# EAGLE design LCD&ControlRev1 (EAGLE 9.2.2)
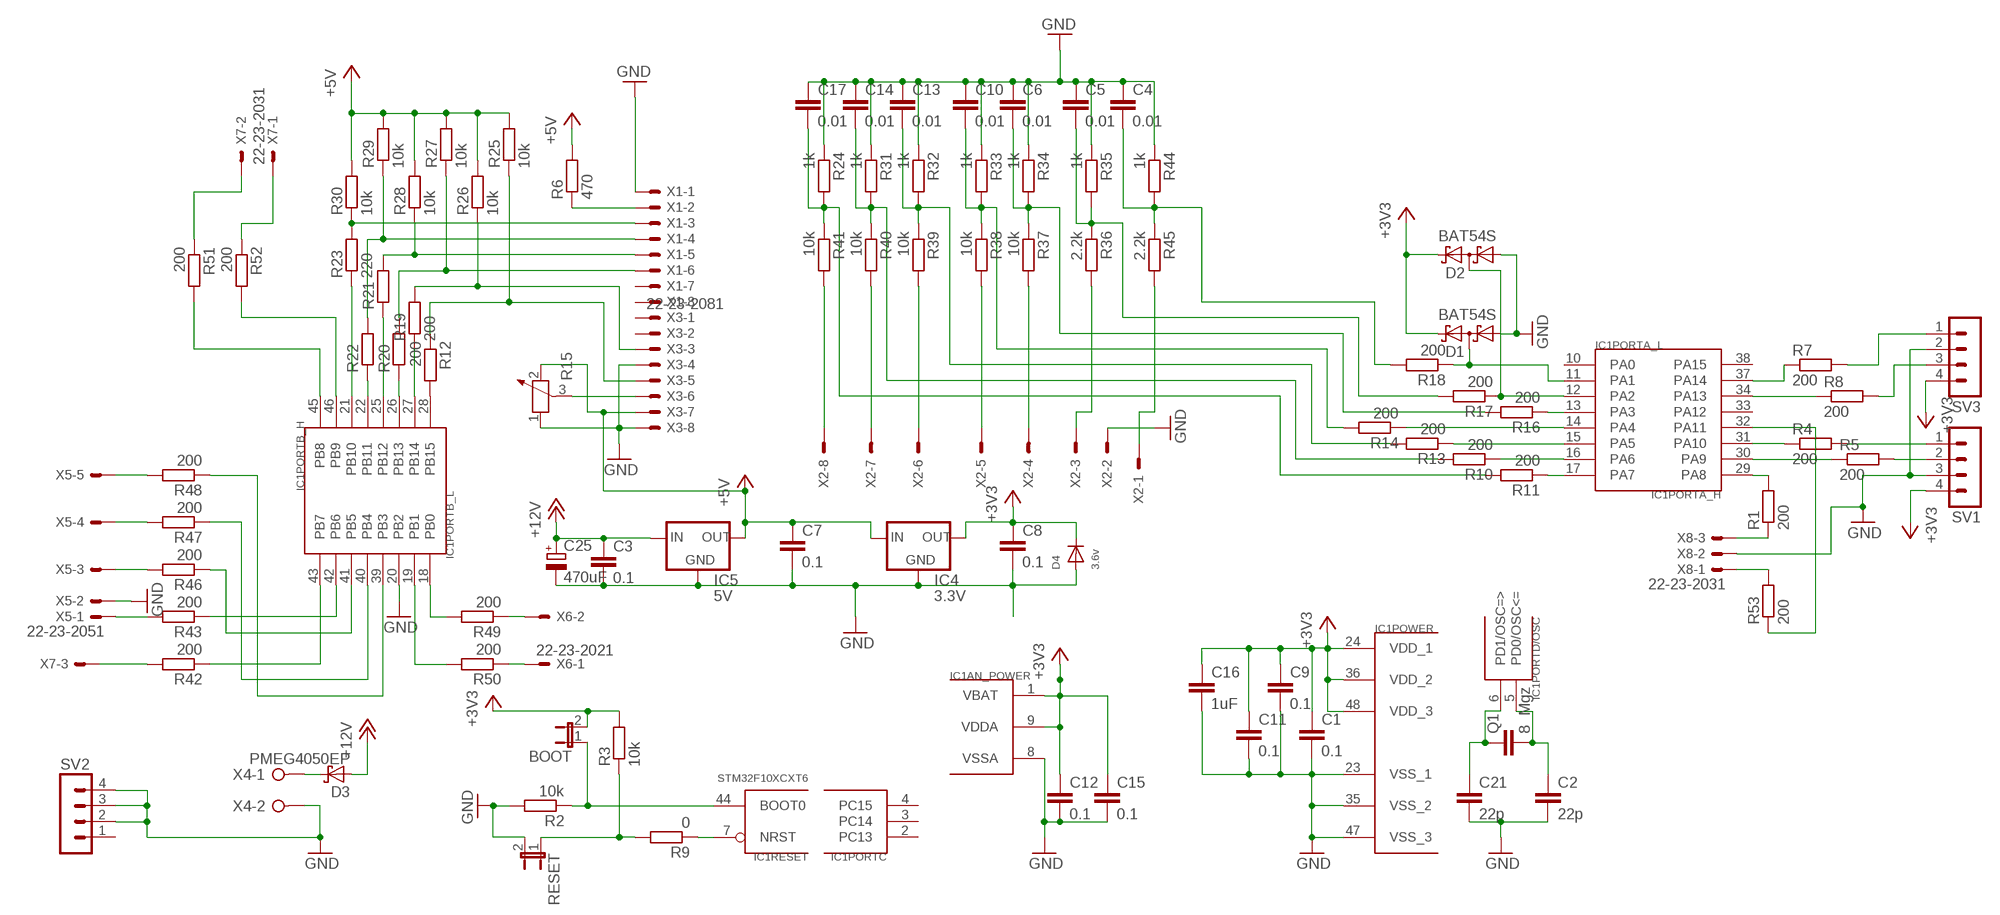
[diagram p0: schematic, sheet 1]

## Parts
BOOT  JP1E  [JP1]
C1  0.1  C-EUC0402  [C0402]
C2  22p  C-EUC0603  [C0603]
C3  0.1  C-EUC1206  [C1206]
C4  0.01  C-EUC0603  [C0603]
C5  0.01  C-EUC0603  [C0603]
C6  0.01  C-EUC0603  [C0603]
C7  0.1  C-EUC1206  [C1206]
C8  0.1  C-EUC1206  [C1206]
C9  0.1  C-EUC0402  [C0402]
C10  0.01  C-EUC0603  [C0603]
C11  0.1  C-EUC0402  [C0402]
C12  0.1  C-EUC0402  [C0402]
C13  0.01  C-EUC0603  [C0603]
C14  0.01  C-EUC0603  [C0603]
C15  0.1  C-EUC0402  [C0402]
C16  1uF  C-EUC0603  [C0603]
C17  0.01  C-EUC0603  [C0603]
C21  22p  C-EUC0603  [C0603]
C25  470uF  CPOL-EUE5-10.5  [E5-10,5]
D1  BAT54S  [SOT23]
D2  BAT54S  [SOT23]
D3  PMEG4050EP  [SOD128]
D4  3.6v  DIODESOD-123  [SOD-123]
IC1  STM32F10XCXT6  [TQFP48]
IC4  3.3V  LM1117  [SOT223]
IC5  5V  LM1117  [SOT223]
Q1  8 Mgz  C-EU050-024X044  [C050-024X044]
R1  200  R-EU_R0603  [R0603]
R2  10k  R-EU_R0603  [R0603]
R3  10k  R-EU_M1206  [M1206]
R4  200  R-EU_R0603  [R0603]
R5  200  R-EU_R0603  [R0603]
R6  470  R-EU_R0603  [R0603]
R7  200  R-EU_R0603  [R0603]
R8  200  R-EU_R0603  [R0603]
R9  0  R-EU_M1206  [M1206]
R10  200  R-EU_R0603  [R0603]
R11  200  R-EU_R0603  [R0603]
R12  200  R-EU_M1206  [M1206]
R13  200  R-EU_R0603  [R0603]
R14  200  R-EU_R0603  [R0603]
R15  POTENTIOMETER_PT-10S  [PT-10S]
R16  200  R-EU_R0603  [R0603]
R17  200  R-EU_R0603  [R0603]
R18  200  R-EU_R0603  [R0603]
R19  200  R-EU_R0603  [R0603]
R20  R-EU_R0603  [R0603]
R21  R-EU_R0603  [R0603]
R22  R-EU_R0603  [R0603]
R23  220  R-EU_R0603  [R0603]
R24  1k  R-EU_R0603  [R0603]
R25  10k  R-EU_R0603  [R0603]
R26  10k  R-EU_R0603  [R0603]
R27  10k  R-EU_R0603  [R0603]
R28  10k  R-EU_R0603  [R0603]
R29  10k  R-EU_R0603  [R0603]
R30  10k  R-EU_R0603  [R0603]
R31  1k  R-EU_R0603  [R0603]
R32  1k  R-EU_R0603  [R0603]
R33  1k  R-EU_R0603  [R0603]
R34  1k  R-EU_R0603  [R0603]
R35  1k  R-EU_R0603  [R0603]
R36  2.2k  R-EU_R0603  [R0603]
R37  10k  R-EU_R0603  [R0603]
R38  10k  R-EU_R0603  [R0603]
R39  10k  R-EU_R0603  [R0603]
R40  10k  R-EU_R0603  [R0603]
R41  10k  R-EU_R0603  [R0603]
R42  200  R-EU_R0603  [R0603]
R43  200  R-EU_R0603  [R0603]
R44  1k  R-EU_R0603  [R0603]
R45  2.2k  R-EU_R0603  [R0603]
R46  200  R-EU_R0603  [R0603]
R47  200  R-EU_R0603  [R0603]
R48  200  R-EU_R0603  [R0603]
R49  200  R-EU_R0603  [R0603]
R50  200  R-EU_R0603  [R0603]
R51  200  R-EU_R0603  [R0603]
R52  200  R-EU_R0603  [R0603]
R53  200  R-EU_R0603  [R0603]
RESET  JP1E  [JP1]
SV1  MA04-1  [MA04-1]
SV2  MA04-1  [MA04-1]
SV3  MA04-1  [MA04-1]
X1  22-23-2081  [22-23-2081]
X2  22-23-2081  [22-23-2081]
X3  22-23-2081  [22-23-2081]
X4  W237-02P  [W237-132]
X5  22-23-2051  [22-23-2051]
X6  22-23-2021  [22-23-2021]
X7  22-23-2031  [22-23-2031]
X8  22-23-2031  [22-23-2031]

## Nets
+3V3: BOOT.2 C1.1 C8.1 C9.1 C11.1 C12.1 C15.1 C16.1 D1.2(C2) D2.2(C2) D4.C IC1.1(AN_POWER:VBAT) IC1.9(AN_POWER:VDDA) IC1.24(POWER:VDD_1) IC1.36(POWER:VDD_2) IC1.48(POWER:VDD_3) IC4.2(OUT) IC4.4(OUT) R3.2 SV1.4 SV3.4
+5V: C7.1 IC4.3(IN) IC5.2(OUT) IC5.4(OUT) R6.2 R15.2 R25.2 R26.2 R27.2 R28.2 R29.2 R30.2 X3.7
+12V: C3.1 C25.+ D3.2(A) IC5.3(IN)
GND: C1.2 C2.2 C3.2 C4.1 C5.1 C6.1 C7.2 C8.2 C9.2 C10.1 C11.2 C12.2 C13.1 C14.1 C15.2 C16.2 C17.1 C21.2 C25.- D1.1(A1) D2.1(A1) D4.A IC1.8(AN_POWER:VSSA) IC1.20(PORTB_L:PB2) IC1.23(POWER:VSS_1) IC1.35(POWER:VSS_2) IC1.47(POWER:VSS_3) IC4.1(GND) IC5.1(GND) R2.2 R15.1 R24.1 R31.1 R32.1 R33.1 R34.1 R35.1 R44.1 RESET.2 SV1.3 SV2.2 SV2.3 SV2.4 SV3.2 X1.1 X2.2 X3.4 X3.8 X4.2 X5.2 X8.2
N$1: IC1.29(PORTA_H:PA8) R1.2
N$3: C21.1 IC1.6(PORTD/OSC:PD1/OSC=>) Q1.1
N$4: C2.1 IC1.5(PORTD/OSC:PD0/OSC<=) Q1.2
N$5: IC1.37(PORTA_H:PA14) R7.1
N$6: IC1.34(PORTA_H:PA13) R8.1
N$7: R7.2 SV3.1
N$8: R3.1 R9.2 RESET.1
N$9: IC1.7(RESET:NRST) R9.1
N$10: IC1.31(PORTA_H:PA10) R4.1
N$11: IC1.30(PORTA_H:PA9) R5.1
N$12: R4.2 SV1.1
N$13: R6.1 X1.2
N$17: R15.3 X3.6
N$21: D3.1(K) X4.1
N$22: R22.2 R29.1 X1.4
N$23: C17.2 R11.2 R24.2 R41.1
N$24: R52.1 X7.1
N$26: R1.1 X8.3
N$27: IC1.46(PORTB_H:PB9) R52.2
N$29: R43.2 X5.1
N$30: R21.2 R28.1 X1.5
N$31: D1.3(C1A2) IC1.11(PORTA_L:PA1) R18.1
N$32: R20.2 R27.1 X1.6
N$33: R19.2 R26.1 X3.3
N$34: R23.2 R30.1 X1.3
N$35: R12.1 R25.1 X3.5
N$36: IC1.21(PORTB_H:PB10) R23.1
N$37: IC1.22(PORTB_H:PB11) R22.1
N$38: IC1.25(PORTB_H:PB12) R21.1
N$44: IC1.45(PORTB_H:PB8) R51.2
N$67: R47.2 X5.4
N$69: R5.2 SV1.2
N$73: R46.2 X5.3
N$78: R48.2 X5.5
N$79: R51.1 X7.2
N$107: R8.2 SV3.3
N$109: IC1.18(PORTB_L:PB0) R49.2
N$112: IC1.43(PORTB_L:PB7) R42.1
N$113: D2.3(C1A2) IC1.12(PORTA_L:PA2) R17.1
N$115: BOOT.1 IC1.44(RESET:BOOT0) R2.1
N$117: R42.2 X7.3
N$123: IC1.42(PORTB_L:PB6) R43.1
N$127: C14.2 R10.2 R31.2 R40.1
N$129: C13.2 R13.2 R32.2 R39.1
N$130: R38.2 X2.5
N$131: IC1.13(PORTA_L:PA3) R16.1
N$132: IC1.19(PORTB_L:PB1) R50.2
N$134: IC1.14(PORTA_L:PA4) R14.1
N$135: C6.2 R16.2 R34.2 R37.1
N$138: C5.2 R17.2 R35.2 R36.1
N$140: IC1.26(PORTB_H:PB13) R20.1
N$141: IC1.27(PORTB_H:PB14) R19.1
N$142: IC1.28(PORTB_H:PB15) R12.2
N$143: R49.1 X6.2
N$160: IC1.15(PORTA_L:PA5) R13.1
N$162: IC1.16(PORTA_L:PA6) R10.1
N$164: R45.2 X2.1
N$165: IC1.41(PORTB_L:PB5) R46.1
N$169: IC1.17(PORTA_L:PA7) R11.1
N$170: R50.1 X6.1
N$171: IC1.40(PORTB_L:PB4) R47.1
N$172: IC1.39(PORTB_L:PB3) R48.1
N$173: C4.2 R18.2 R44.2 R45.1
N$174: R36.2 X2.3
N$175: R37.2 X2.4
N$176: R53.2 X8.1
N$177: IC1.32(PORTA_H:PA11) R53.1
N$178: C10.2 R14.2 R33.2 R38.1
N$179: R39.2 X2.6
N$184: R40.2 X2.7
N$199: R41.2 X2.8
Unconnected: IC1.2(PORTC:PC13) IC1.3(PORTC:PC14) IC1.4(PORTC:PC15) IC1.10(PORTA_L:PA0) IC1.33(PORTA_H:PA12) IC1.38(PORTA_H:PA15) SV2.1 X1.7 X1.8 X3.1 X3.2

## Library data of the parts
BOOT RESET = jumper:JP1E: JUMPER
C1-C3 C7-C9 C11 C12 C15 C16 C21 Q1 = rcl:C-EU: CAPACITOR, European symbol
C4-C6 C10 C13 C14 C17 = rcl:C-EU: CAPACITOR, European symbol; SPICEPREFIX: C
C25 = rcl:CPOL-EU: POLARIZED CAPACITOR, European symbol
D1 D2 = diode:BAT54S: Schottky Diodes Pin connection corrected 2011-05-04 Source: Fairchild .. BAT54.pdf
D3 = nxp_60:PMEG4050E: 40 V, 5 A low VF MEGA Schottky barrier rectifier Planar Maximum Efficiency General Application (MEGA) Schottky barrier rectifier with an integrated guard ring for stress protection. AAL Eindhoven MK
D4 = adafruit:DIODE: Diode SMADIODE - SMA Surface Mount Package 20V 1A Schottky Diode Digikey: 641-1014-6-ND DO-1N4148 - Through Hole Small Current Diode SOD-123 20V 1 A (.5mV Vf) Schottky Diode - Digikey: MBRX120TPMSCT-ND SOD-323 10V 570mA (.38mV Vf, 3ns) Schottky Diode - Digikey: ZLLS410CT-ND SOD-523 30V 30mA Schottky Diode (RB751S-40TE61) - Digikey: RB751S-40TE61CT-ND SOT23-R/W - SOT23 Package (R = Solder Paste/Reflow Ovens, W = Hand-Soldering) BAT54Film 40V 300mA - Digikey: 497-7162-1-ND
IC1 = stm32(1):STM32F10XCXT6: ST STM32F101/103 48pin LQFP
IC4 IC5 = v-reg-2:LM1117
R1-R14 R16-R34 R36-R53 = rcl:R-EU_: RESISTOR, European symbol
R15 = rcl:POTENTIOMETER_: Potentiometer
R35 = rcl:R-EU_: RESISTOR, European symbol; SPICEPREFIX: R
SV1-SV3 = con-lstb:MA04-1: PIN HEADER; OC_FARNELL: unknown; OC_NEWARK: unknown
X1-X3 = con-molex:22-23-2081: .100" (2.54mm) Center Header - 8 Pin; MF: MOLEX; MPN: 22-23-2081; OC_FARNELL: 1756826; OC_NEWARK: 01C7592
X4 = con-wago-508:W237-02P: WAGO SREW CLAMP; OC_FARNELL: unknown; OC_NEWARK: unknown
X5 = con-molex:22-23-2051: .100" (2.54mm) Center Header - 5 Pin; MF: MOLEX; MPN: 22-23-2051; OC_FARNELL: 1462952; OC_NEWARK: 38C9178
X6 = con-molex:22-23-2021: .100" (2.54mm) Center Header - 2 Pin; MF: MOLEX; MPN: 22-23-2021; OC_FARNELL: 1462926; OC_NEWARK: 25C3832
X7 X8 = con-molex:22-23-2031: .100" (2.54mm) Center Header - 3 Pin; MF: MOLEX; MPN: 22-23-2031; OC_FARNELL: 1462950; OC_NEWARK: 30C0862

## Board
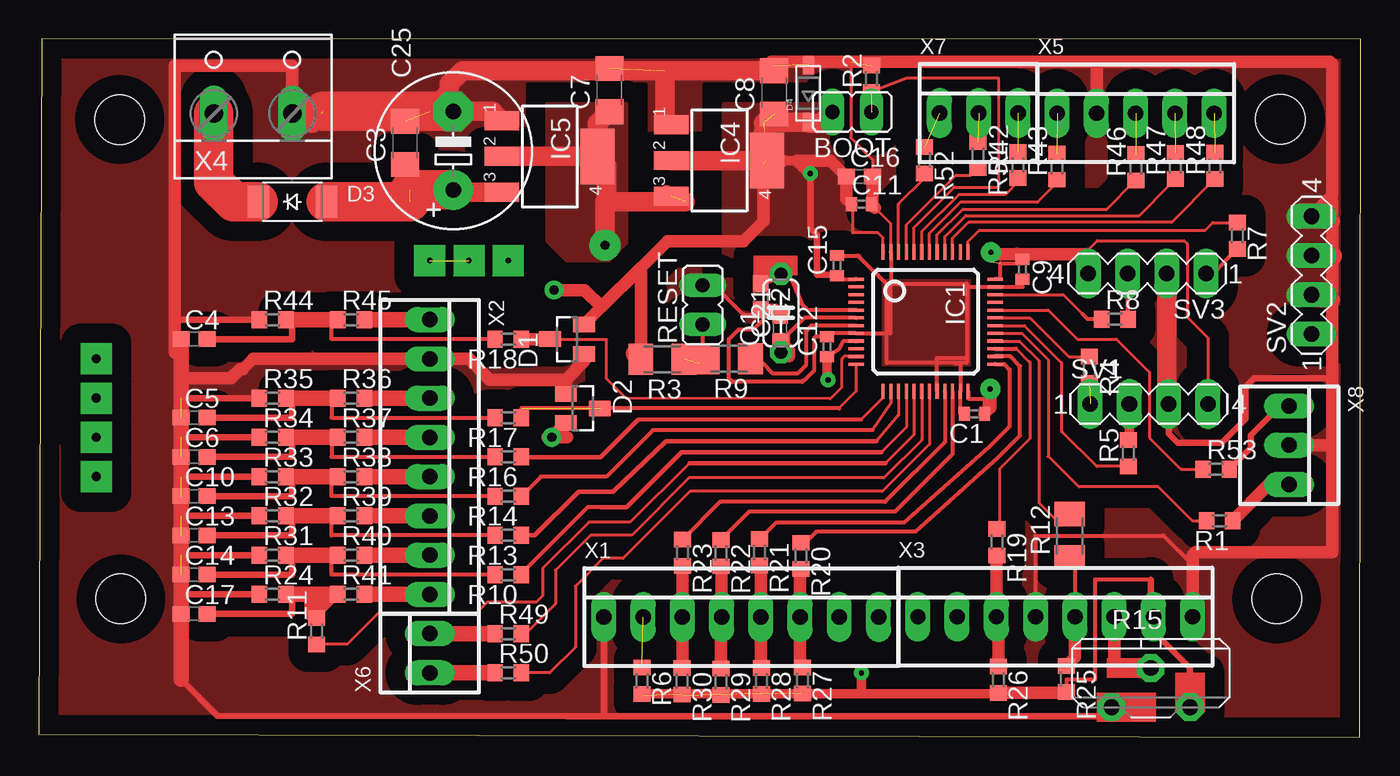
[diagram p1: board, top side]
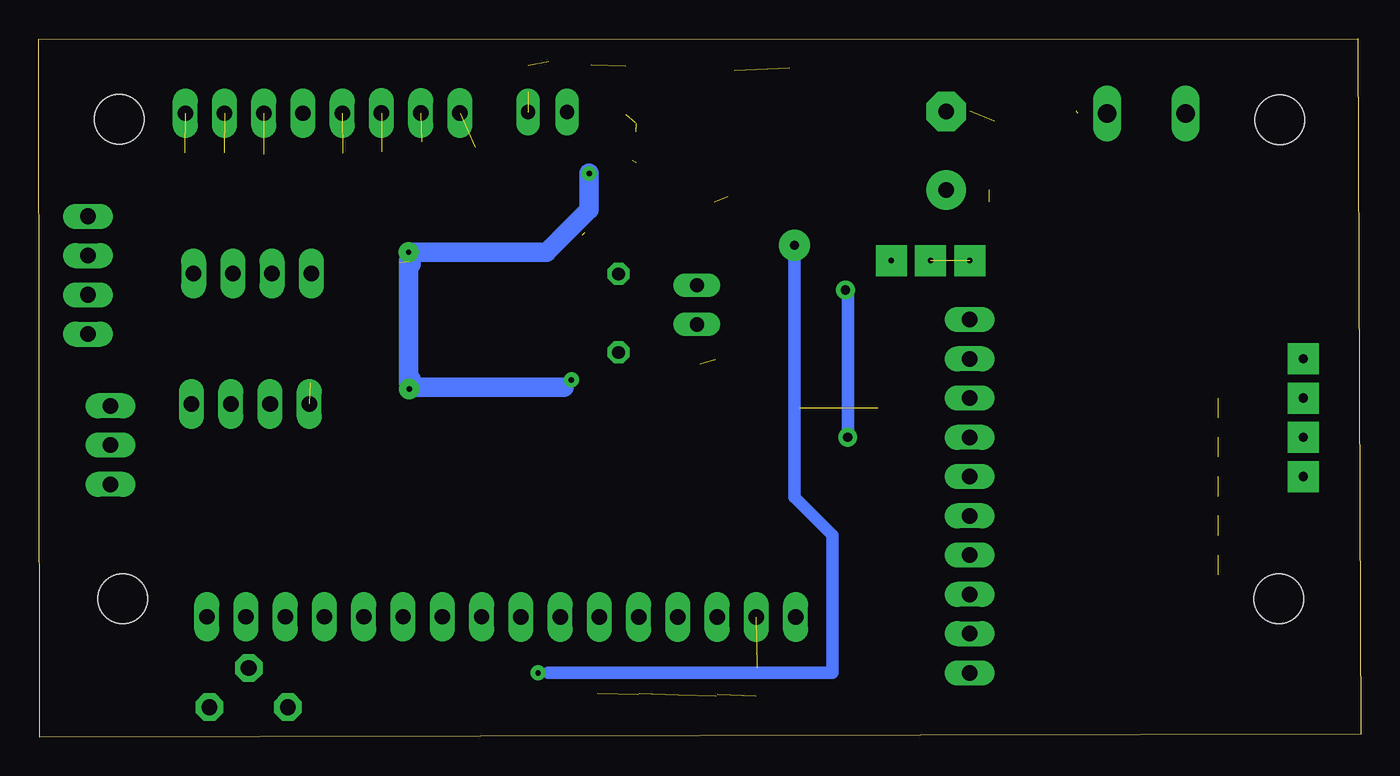
[diagram p2: board, bottom side, seen from below]

Size 85.58 x 45.19 mm. Coordinates in mm from the lower left corner, seen from the top.
Outline: 0,0.19 85.51,0 85.58,45.15 0.19,45.19 0,0.19
Copper layers (1*16): Top 0.035mm / dielectric 1.5mm / Bottom 0.035mm
Design rules "DRC LCD part *": minimum track width 7mil, minimum drill 0.6mm, track to track 9mil, track to pad 10mil, pad to pad 12mil, via to via 12mil, smd to smd 2mil, copper to edge 40mil, drill to drill 40mil, minimum pad ring 12mil, minimum via ring 12mil, stop-mask expansion 4mil, vias tented up to drill 0mil, thermal gap 10mil
Holes 3.2 mm at 5.32,8.94 5.25,39.95 80.37,39.97 80.12,8.94

### Footprints (pad centres in the part's own frame; a part is rotated, then mirrored left to right if it is on the bottom)
JP1 = drill 0.914 long: 1 0,-1.27; 2 0,1.27
C0402 = smd 0.7 x 0.9: 1 -0.65,0; 2 0.65,0
C0603 = smd 1.1 x 1: 1 -0.85,0; 2 0.85,0
C1206 = smd 1.6 x 1.8: 1 -1.4,0; 2 1.4,0
E5-10,5 = drill 1.016 pad 2.54: + -2.54,0 | drill 1.016 pad 2.54 octagon: - 2.54,0
SOT23 = smd 1 x 1.4: 1 -0.95,-1.1; 2 0.95,-1.1; 3 0,1.1
SOD128 = smd 1.4 x 2.1: 1 -2.2,0; 2 2.2,0
SOD-123 = smd 1.2 x 0.7: A 1.85,0; C -1.85,0
TQFP48 = smd 0.2 x 1: 1 -2.75,-4.5; 2 -2.25,-4.5; 3 -1.75,-4.5; 4 -1.25,-4.5; 5 -0.75,-4.5; 6 -0.25,-4.5; 7 0.25,-4.5; 8 0.75,-4.5; 9 1.25,-4.5; 10 1.75,-4.5; 11 2.25,-4.5; 12 2.75,-4.5; 25 2.75,4.5; 26 2.25,4.5; 27 1.75,4.5; 28 1.25,4.5; 29 0.75,4.5; 30 0.25,4.5; 31 -0.25,4.5; 32 -0.75,4.5; 33 -1.25,4.5; 34 -1.75,4.5; 35 -2.25,4.5; 36 -2.75,4.5 | smd 1 x 0.2: 13 4.5,-2.75; 14 4.5,-2.25; 15 4.5,-1.75; 16 4.5,-1.25; 17 4.5,-0.75; 18 4.5,-0.25; 19 4.5,0.25; 20 4.5,0.75; 21 4.5,1.25; 22 4.5,1.75; 23 4.5,2.25; 24 4.5,2.75; 37 -4.5,2.75; 38 -4.5,2.25; 39 -4.5,1.75; 40 -4.5,1.25; 41 -4.5,0.75; 42 -4.5,0.25; 43 -4.5,-0.25; 44 -4.5,-0.75; 45 -4.5,-1.25; 46 -4.5,-1.75; 47 -4.5,-2.25; 48 -4.5,-2.75
SOT223 = smd 1.219 x 2.235: 1 -2.311,-3.099; 2 0,-3.099; 3 2.311,-3.099 | smd 3.6 x 2.2: 4 0,3.099
C050-024X044 = drill 0.813 octagon: 1 -2.54,0; 2 2.54,0
R0603 = smd 1 x 1.1: 1 -0.85,0; 2 0.85,0
M1206 = smd 1.6 x 2: 1 -1.4,0; 2 1.4,0
PT-10S = drill 1.016 pad 1.778 octagon: 1 -2.54,-1.27; 2 2.54,-1.27; 3 0,1.27
MA04-1 = drill 1.016 long: 1 -3.81,0; 2 -1.27,0; 3 1.27,0; 4 3.81,0
22-23-2081 = drill 1 long: 1 -8.89,0; 2 -6.35,0; 3 -3.81,0; 4 -1.27,0; 5 1.27,0; 6 3.81,0; 7 6.35,0; 8 8.89,0
W237-132 = drill 1.194 long: 1 -2.54,-0.635; 2 2.54,-0.635
22-23-2051 = drill 1 long: 1 -5.08,0; 2 -2.54,0; 3 0,0; 4 2.54,0; 5 5.08,0
22-23-2021 = drill 1 long: 1 -1.27,0; 2 1.27,0
22-23-2031 = drill 1 long: 1 -2.54,0; 2 0,0; 3 2.54,0

### Placement (x,y rotation side)
BOOT  52.64,40.44 90 top
C1  60.57,20.93 180 top
C2  46.73,28.49 270 top
C3  23.72,38.44 90 top
C4  10.07,25.74 0 top
C5  10.07,20.66 0 top
C6  10.07,18.12 0 top
C7  36.94,41.86 90 top
C8  47.6,41.71 90 top
C9  63.67,30.26 270 top
C10  10.07,15.58 0 top
C11  53.25,34.47 0 top
C12  51.03,25.25 90 top
C13  10.07,13.04 0 top
C14  10.07,10.5 0 top
C15  51.66,30.51 90 top
C16  53.12,36.26 0 top
C17  10.07,7.96 0 top
C21  47.99,26.44 90 top
C25  26.84,37.93 90 top
D1  34.2,25.74 90 top
D2  35.23,21.26 270 top
D3  16.42,34.63 0 top
D4  49.82,41.64 90 top
IC1  57.4,26.87 270 top
IC4  44.06,37.3 270 top
IC5  33.08,37.57 270 top
Q1  48.04,27.43 90 top
R1  76.43,14 180 top
R2  53.91,42.6 90 top
R3  40.37,24.43 180 top
R4  68.02,23.76 270 top
R5  70.54,18.36 90 top
R6  39.04,3.64 270 top
R7  77.58,32.44 270 top
R8  69.66,27.04 0 top
R9  44.68,24.47 180 top
R10  30.39,10.5 180 top
R11  17.98,6.85 90 top
R12  66.73,13.02 90 top
R13  30.39,13.04 180 top
R14  30.39,15.58 180 top
R15  71.98,3.2 0 top
R16  30.39,18.12 180 top
R17  30.39,20.66 180 top
R18  30.39,25.74 180 top
R19  62.03,12.61 270 top
R20  49.34,11.72 270 top
R21  46.65,11.95 270 top
R22  44.16,11.9 270 top
R23  41.67,11.93 270 top
R24  15.15,9.23 0 top
R25  66.52,3.76 270 top
R26  62.1,3.71 270 top
R27  49.43,3.66 270 top
R28  46.77,3.63 270 top
R29  44.16,3.58 270 top
R30  41.66,3.61 270 top
R31  15.15,11.77 0 top
R32  15.15,14.31 0 top
R33  15.15,16.85 0 top
R34  15.15,19.39 0 top
R35  15.15,21.93 0 top
R36  20.23,21.93 0 top
R37  20.23,19.39 0 top
R38  20.23,16.85 0 top
R39  20.23,14.31 0 top
R40  20.23,11.77 0 top
R41  20.23,9.23 0 top
R42  63.39,37.01 90 top
R43  65.91,36.91 90 top
R44  15.15,27.01 0 top
R45  20.23,27.01 0 top
R46  71.01,36.87 90 top
R47  73.57,36.94 90 top
R48  76.14,36.96 90 top
R49  30.39,6.69 0 top
R50  30.39,4.15 0 top
R51  60.79,37.66 270 top
R52  57.32,37.33 270 top
R53  76.21,17.34 0 top
RESET  42.98,27.97 0 top
SV1  71.87,21.55 0 top
SV2  82.38,29.88 90 top
SV3  71.74,29.98 180 top
X1  45.48,7.76 0 top
X2  25.31,18.12 270 top
X3  65.8,7.79 0 top
X4  13.88,40.98 0 top
X5  71.01,40.36 0 top
X6  25.31,5.42 90 top
X7  60.85,40.37 0 top
X8  80.94,18.88 270 top

### Tracks (layer width: path | path; a pad name or v marks a point on that pad's centre or on a via)
+3V3  (via drill 0.35, 0.35 pad 1.3, 0.6)  (5 unrouted)
  Top 0.203: SV3.4 67.93,31.53 68.52,32.12 74.13,32.12 74.33,31.91 74.33,27.16 75.68,25.82 SV1.4 | IC1.48 54.65,32.29 54.32,32.63 52.69,32.63 52.69,34.38 C11.1
  Top 0.254: IC1.24 60.17,22.37 60.17,21.9 61.22,21.9 C1.1 | IC1.36 62.26,29.62 62.26,30.67 63.67,30.67 C9.1 | C15.1 51.77,29.85 51.99,29.64 52.89,29.64 IC1.1 | 52.9,25.6 IC1.9 52.88,25.6 52.06,25.6 51.8,25.09 C12.1 | 63.42,31.38 63.31,31.27 | IC1.48
  Top 0.406: v61.63,31.37 61.77,31.23 | C15.1 51.6,29.92 50.37,29.92 50.37,32.51 | 50.23,32.65 49.95,32.93 v49.95,36.46
  Top 0.61: 49.11,37.3 48.17,37.3 | C12.1 51.03,23.18 v51.09,23.11
  Top 0.813: C9.1 63.31,31.27 | C1.1 61.6,21.3 v61.6,22.52 | 50.01,39.6 D4.C | 35.47,26.86 arc-90 D1.2 36.44,27.83 | D2.2 v33.21,19.39 | v33.21,19.39 32.93,19.39 | v33.21,19.39 34.2,19.39 | SV3.4 67.93,31.23 61.77,31.23 | C11.1 52.27,34.79 C16.1 51.23,37.3 49.11,37.3 v49.95,36.46 | 48.17,37.3 IC4.4 | 36.44,27.83 38.97,30.36 | 38.97,30.36 40.7,32.09 45.63,32.09 46.9,33.36 46.9,37.17 | R3.2 38.97,30.36 | v33.36,28.92 35.34,28.92 36.44,27.83
  Top 1.27: R3.2 38.62,24.79 | 46.94,39.15 46.9,39.12 47.16,38.86 IC4.4 IC4.2 | BOOT.2 50.71,39.78 50.71,39.71 49.9,39.71 D4.C 46.98,39.79 46.9,39.71
  Bottom 0.406: v61.6,22.52 61.79,22.71 61.63,22.93 | 61.47,30.59 61.63,30.76 61.63,30.82
  Bottom 0.813: v51.09,23.11 51.56,22.64 | v33.21,19.39 33.21,28.77 v33.36,28.92 | 61.56,23.08 61.56,22.64 61.56,22.55 v61.6,22.52 | v61.63,31.37 61.63,30.82
  Bottom 1.27: 51.56,22.64 61.56,22.64 | 61.47,23.16 61.56,23.08 | 61.47,30.59 61.47,31.38 52.69,31.38 49.95,34.12 v49.95,36.46 | 61.63,30.82 61.63,22.93
  pour Top (isolate 1.27, no thermals): 44.36,40.98 55.79,40.98 55.79,30.82 44.36,30.82
+5V  (via drill 0.35, 0.6 pad 2)  (5 unrouted)
  Top 0.254: 71.98,10.18 68.36,10.18 68.36,3.71 66.52,3.71 R25.2
  Top 0.406: 71.98,7.78 71.98,10.18 | R15.2 74.52,4.47 72.3,6.69 72.3,7.33 71.67,7.96 71.97,7.96 X3.7
  Top 0.61: 64.68,2.86 64.62,2.79 53.25,2.79 | R6.2 53.25,2.79 | 53.25,2.79 v53.25,4.15
  Top 0.813: 41.73,2.68 R30.2 | 46.72,2.83 R28.2 | 49.4,2.83 R27.2 | R26.2 64.68,2.86 66.47,2.86 R25.2 | X3.7 71.98,7.78 | 39.15,2.68 R6.2 | IC4.3 40.64,35.31
  Top 1.27: IC5.2 IC5.4 | IC5.4 36.18,39.7 C7.1 | IC5.4 36.74,37.01 36.74,34.63 | 36.74,34.63 36.67,34.63 v36.67,31.81 | 36.74,34.63 41.82,34.63
  Bottom 0.61: v53.25,4.15 52.59,4.15
  Bottom 0.813: v36.67,31.81 36.67,15.51 34.2,13.04 34.2,4.15 52.59,4.15
  pour Top (isolate 1.27, no thermals): 32.93,40.98 38.01,40.98 38.01,30.82 34.2,30.82 32.93,32.09
+12V  (1 unrouted)
  Top 1.27: IC5.3 26.98,35.25 C25.+ | 24.04,35.39 23.72,35.71 C3.1
  Top 2.54: 24.04,35.39 C25.+ | D3.2 24.04,34.63
GND  (10 unrouted)
  Top 0.203: 52.57,43.7 52.57,38.77 53.97,37.36 C16.2 | IC1.47 55.15,33.21 54.13,34.24 C11.2
  Top 0.254: IC1.47 55.15,29.36 55.25,29.36 55.25,29.34 60.07,29.34 60.07,29.12 | 60.07,29.12 60.07,24.54 | 60.07,24.54 60.07,24.21 59.67,24.21 | 59.36,24.21 54.89,24.21 54.89,26.06 | 54.89,26.06 54.89,29.29 | 54.89,29.29 55.12,29.29 55.12,26.12 | 60.07,29.12 IC1.35 63.67,29.12 C9.2 | 59.59,24.21 59.36,24.21 | 59.36,24.21 59.36,24.18 59.59,24.18 59.59,24.21 | 59.59,24.21 59.67,24.21 | 59.67,24.21 59.67,22.37 IC1.23 59.65,20.93 C1.2 | IC1.20 58.15,24.54 60.07,24.54 | IC1.47 | IC1.47 | 54.89,26.06 54.83,26.12 IC1.8 51.08,26.12 C12.2 50.3,25.9 50.18,25.79 50.18,23.71 49.53,23.06 49.5,23.06 49.42,22.97 44.91,22.97 44.68,23.2 44.68,25.74 45.31,26.38 46.27,26.38 46.9,27.01 46.9,27.47 C2.2 46.42,27.33 45.63,27.33 43.73,29.23 RESET.2 | C15.2 53.02,31.15 54.89,29.29 | X3.4 64.53,13.03 72.8,13.03 74.69,11.14 | 54.24,36.6 C16.2
  Top 0.406: X3.8 74.69,11.14 74.69,11.77 | 83.73,16.85 83.73,18.88 83.73,23.2 | 83.73,23.2 83.73,28.28 83.73,31.1 83.73,33.36 83.73,34.63 83.73,43.52 | R31.1 9.22,11.77 | R24.1 9.22,9.23 | R32.1 9.22,14.31 | R33.1 9.22,16.85 | R34.1 9.22,19.39 | R35.1 9.22,21.93 | R44.1 8.8,27.01 8.8,24.89 9.22,24.47 | SV1.3 73.14,19.62 73.72,19.04 76.57,19.04 78.09,20.56 78.09,22.64 78.65,23.2 83.73,23.2 | R15.1 68.85,1.33 36.74,1.33 | 9.22,3.73 11.57,1.38 34.21,1.33 36.74,1.33 | X1.1 36.59,1.49 36.74,1.33
  Top 0.61: C16.2 53.9,36.19 | R15.1 69.04,1.52
  Top 0.813: C2.2 47.64,27.64 C21.2 | 9.22,23.2 12.43,23.2 13.03,23.8 13.21,23.8 13.88,24.47 X2.2 27.85,24.47 29.19,23.13 34.13,23.13 | X4.2 16.42,43.45 | 16.42,43.45 | 16.42,43.45 8.8,43.42 8.8,24.89 9.22,24.47 | D1.1 35.3,24.3 34.13,23.13 | 34.13,23.13 D2.1 | X3.8 74.69,11.77 74.88,11.96 83.73,11.96 83.73,16.85 83.73,23.2 83.73,34.63 | X8.2 83.73,18.88 | SV2.4 83.73,35.04 83.73,43.52 | 83.73,43.52 83.66,43.52 | 83.73,43.52 83.55,43.7 68.49,43.7 | C8.2 47.6,43.43 47.38,43.65 47.43,43.7 52.57,43.7 68.49,43.7 | X5.2 68.49,40.39 68.49,43.7 | C16.2 53.97,34.39 54.13,34.24
  Top 1.016: C4.1 9.22,24.47 9.22,23.2 9.22,21.93 9.22,19.39 9.22,16.85 9.22,14.31 9.22,11.77 9.22,9.23 C17.1 9.22,3.73 | SV2.3 82.44,31.1 82.46,31.1 | SV2.2 82.72,28.28 83.73,28.28 | SV2.4 83.4,33.69 83.73,33.36
  Top 1.27: IC5.1 29.39,40.47 C25.- | 47.56,43.07 C8.2 40.55,43.11 | C7.2 36.97,43.28 | 83.73,31.1 82.46,31.1 | 17.69,39.71 18.33,40.35 X4.2 | SV3.2 73.01,21.68 SV1.3 | 40.55,43.11 27.44,43.11 26.58,42.25 26.58,41.74 25.31,40.47 | IC4.1 40.55,40.02 40.55,43.11
  Top 2.54: C25.- 25.31,40.47 18.41,40.47
  pour Top (isolate 0.406, rank 2, no thermals): 54.65,29.55 60.29,29.55 60.29,24.07 54.65,24.07
  pour Top (isolate 1.27, rank 3, no thermals): -0.09,44.79 85,44.79 85,0.34 -0.09,0.34
N$1
  Top 0.203: IC1.29 63.64,26.12 65.34,24.42 65.34,18.17 | 65.34,18.17 65.32,18.15 | 65.34,18.17 67.34,16.18 72.48,16.18 74.66,13.99 R1.2
N$3
  Top 0.254: IC1.6 49.55,27.12 48.49,26.06 48.49,24.7 48.55,24.64
  Top 0.813: Q1.1 48.55,24.64 48.55,25.03 C21.1
N$4
  Top 0.254: IC1.5 49.78,27.62 49.44,27.96 48.81,29.46 Q1.2
  Top 0.813: Q1.2 47.11,29.72 C2.1
N$5
  Top 0.203: IC1.37 60.15,32.06 60.9,32.8 75.5,32.8 75.98,33.29 R7.1
N$6
  Top 0.203: IC1.34 66.32,28.62 67.58,27.37 67.86,27.09
  Top 0.254: R8.1 67.91,27.04 67.58,27.37
N$7
  Top 0.254: R7.2 75.98,29.98 SV3.1
N$8  (1 unrouted)
  Top 0.254: RESET.1 42.98,24.36 42.77,24.15 42.96,24.15 R9.2
N$9
  Top 0.254: IC1.7 50,26.62 49.76,26.38 49.76,26.32 49.7,26.26 49.68,26.26 49.65,26.23 49.65,24.05 49.12,23.52 47.54,23.52 46.9,24.15 46.4,24.15 R9.1
N$10
  Top 0.203: IC1.31 64.16,27.12 66.68,24.61 R4.1
N$11
  Top 0.203: IC1.30 63.8,26.62 66.21,24.22 66.21,19.72 66.27,19.72 68.48,17.51 R5.1
N$12  (1 unrouted)
N$13  (1 unrouted)
  Top 1.27: X1.2
N$15  (via drill 0.35 pad 2)  (1 unrouted)
  other vias: 27.85,30.82 25.31,30.82
N$17
  Top 0.813: R15.3 69.61,4.47 X3.6
N$21
  Top 2.54: D3.1 12.61,34.63 11.34,35.9 X4.1
N$22
  Top 0.813: R29.1 44.16,7.71 X1.4 44.21,11 R22.2
N$23
  Top 0.254: 18.96,9.23 R41.1
  Top 0.406: C17.2 16.42,7.96 16.42,9.23
  Top 1.016: R24.2 16.42,9.23 17.69,9.23 | 17.69,9.23 18.96,9.23 17.98,8.25 R11.2 17.69,7.99 17.69,9.23
N$24  (1 unrouted)
N$26
  Top 0.813: R1.1 79.63,16.34 X8.3
N$27
  Top 0.203: IC1.46 55.65,34.5 57.32,36.16 R52.2
N$29  (1 unrouted)
N$30
  Top 0.813: R21.2 46.75,11 X1.5 46.75,4.51 R28.1
N$31
  Top 0.203: IC1.11 52.13,24.62 51.98,24.47 51.98,22.63 51.24,21.89 38.01,21.93 36.77,23.18 36.77,25.72 32.47,25.72 32.45,25.74
  Top 0.813: D1.3 32.45,25.74 R18.1
N$32
  Top 0.813: R20.2 49.29,10.82 X1.6 49.29,4.65 R27.1
N$33
  Top 0.813: R26.1 62.1,7.67 X3.3 61.99,11.72 R19.2
N$34
  Top 0.813: R30.1 41.67,4.47 X1.3 R23.2
N$35
  Top 0.254: R12.1 67.07,11.71 X3.5
  Top 0.813: X3.5 67.07,5.15 R25.1
N$36
  Top 0.254: IC1.21 58.65,19.08 54.79,15.21 44.11,15.21 R23.1
N$37
  Top 0.254: IC1.22 59.15,18.31 55.42,14.58 45.99,14.58 R22.1
N$38
  Top 0.254: IC1.25 62.49,24.12 62.84,23.77 62.84,20.09 61.51,18.76 56.02,13.88 47.73,13.88 R21.1
N$44
  Top 0.203: IC1.45 56.15,33.14 59.37,36.36 60.35,36.36 R51.2
N$67  (1 unrouted)
N$69
  Top 0.61: R5.2 70.6,19.28 SV1.2
N$73  (1 unrouted)
N$78  (1 unrouted)
N$79  (1 unrouted)
N$107
  Top 0.254: R8.2 70.51,29.95 SV3.3
N$109
  Top 0.203: IC1.18 57.15,19.22 54.7,16.76 42.09,16.76 38.39,13.07 35.73,13.07 33.45,10.79 33.45,8.64 31.51,6.69 R49.2
N$112
  Top 0.203: R42.1 63.39,35.93 62.56,35.1 59.55,35.1 57.15,32.71 IC1.43
N$113  (1 unrouted)
  Top 0.203: IC1.12 52.9,22.37 51.8,21.27
  Top 0.254: 51.8,21.27 31.24,21.27
  Top 0.305: R17.1 31.24,21.27
N$115  (1 unrouted)
  Top 0.203: IC1.44 56.65,32.96 59.27,35.57 62.14,35.57 62.14,42.63 56.2,42.63 R2.1
N$117  (1 unrouted)
N$123
  Top 0.203: R43.1 65.91,35.85 64.66,34.59 59.65,34.59 57.65,32.6 IC1.42
N$127
  Top 0.254: R10.2 18.96,10.5 18.96,11.77 R40.1
  Top 0.406: C14.2 16.42,10.5 16.42,11.77
  Top 1.016: R40.1 16.42,11.77 R31.2
N$129
  Top 0.254: R13.2 18.96,13.04 18.96,13.89 R39.1
  Top 0.406: C13.2 16.42,13.04 16.42,14.31
  Top 1.016: R39.1 16.42,14.31 R32.2
N$130
  Top 1.016: X2.5 R38.2
N$131
  Top 0.203: 54.65,22.19 IC1.13 54.65,21.96 53.23,20.54 | 31.27,18.1 R16.1
  Top 0.254: 53.23,20.54 38.8,20.54
  Top 0.305: 38.8,20.54 36.36,18.1 31.27,18.1
N$132
  Top 0.203: IC1.19 57.65,18.94 54.6,15.89 42.16,15.89 37.83,11.56 36.53,11.56 34.73,9.77 34.73,5.82 33.07,4.15 R50.2
N$134
  Top 0.203: IC1.14 55.15,21.58 53.97,19.86 | 31.34,15.68 R14.1
  Top 0.254: R14.1 32.51,16.85 36.74,16.85 39.75,19.86 53.97,19.86
N$135
  Top 0.254: R16.2 18.96,18.12 18.96,18.97 R37.1
  Top 0.406: C6.2 16.42,18.12 16.42,19.39
  Top 1.016: R37.1 16.42,19.39 R34.2
N$138
  Top 0.254: R17.2 18.96,20.66 18.96,21.93 R36.1
  Top 0.406: C5.2 16.42,20.66 16.42,21.93
  Top 1.016: R36.1 16.42,21.93 R35.2
N$140
  Top 0.254: R20.1 49.64,12.57 50.34,13.28 56.73,13.28 62.14,18.12 63.51,19.49 63.51,24 62.88,24.63 IC1.26
N$141
  Top 0.203: 63.27,25.12 64.1,24.29 64.15,24.29 64.15,19.29 62.19,17.34 62.19,13.63 62.19,13.47
  Top 0.254: IC1.27 63.27,25.12 | 62,13.66 62.19,13.47 | 62.19,13.63 R19.1
N$142
  Top 0.203: IC1.28 63.48,25.62 64.73,24.37 64.73,15.17 66.1,13.8
  Top 0.254: 66.1,13.8 R12.2
N$143
  Top 1.016: R49.1 X6.2
N$160
  Top 0.203: IC1.15 55.65,20.81 54.22,19.15
  Top 0.305: 54.22,19.15 40.61,19.15 37.17,15.87 34.94,15.87 32.11,13.04 R13.1
N$162
  Top 0.203: IC1.16 56.15,20.03 54.55,18.43
  Top 0.254: 36.74,14.86 35.53,14.86 31.59,10.91 31.59,10.85 R10.1
  Top 0.305: 36.4,14.86 36.74,14.86 38.04,14.86 41.61,18.43 54.55,18.43
N$164
  Top 1.016: R45.2 X2.1
N$165
  Top 0.203: R46.1 70.96,35.97 70.93,35.97 69.13,34.16 59.83,34.16 58.15,32.49 IC1.41
N$169
  Top 0.203: IC1.17 56.65,19.57 54.81,17.73 | 42.11,17.73 38.29,13.91 35.61,13.91 32.63,10.92 32.63,9.14 32.21,8.72 29.03,8.72 28.27,7.96 21.93,7.96 19.97,5.99 R11.1
  Top 0.305: 54.81,17.73 42.11,17.73
N$170
  Top 1.016: R50.1 X6.1
N$171
  Top 0.203: R47.1 73.19,35.71 73.19,35.69 71.23,33.73 60.01,33.73 58.65,32.38 IC1.40
N$172
  Top 0.203: IC1.39 59.15,32.27 60.19,33.3 73.33,33.3 R48.1
N$173
  Top 0.254: R18.2 18.96,25.74 18.96,26.59 R45.1
  Top 0.406: C4.2 16.42,25.74 16.42,27.01
  Top 1.016: R44.2 16.42,27.01 R45.1
N$174
  Top 1.016: R36.2 X2.3
N$175
  Top 1.016: X2.4 R37.2
N$176
  Top 0.406: R53.2 78.45,18.72 78.45,19.52 80.23,21.3 80.81,21.3 X8.1
  Top 0.813: 80.94,21.21 X8.1
N$177
  Top 0.203: IC1.32 65.34,27.62 67.22,25.74 69.76,25.74 71.9,23.61 71.9,19.37 73.93,17.34 R53.1
N$178
  Top 0.254: R14.2 18.96,15.58 18.96,16.85 R38.1
  Top 0.406: C10.2 16.42,15.58 16.42,16.85
  Top 1.016: R38.1 16.42,16.85 R33.2
N$179
  Top 1.016: X2.6 R39.2
N$183  (via drill 0.35 pad 2)
  other vias: 30.39,30.82
N$184
  Top 1.016: X2.7 R40.2
N$199
  Top 1.016: R41.2 X2.8
N$201  (via drill 0.6 pad 2)
  other vias: 3.72,16.85
N$202  (via drill 0.6 pad 2)
  other vias: 3.72,19.39
N$203  (via drill 0.6 pad 2)
  other vias: 3.72,21.93
N$204  (via drill 0.6 pad 2)
  other vias: 3.72,24.47
(copper drawn outside any net)
  shapes: Top area x4